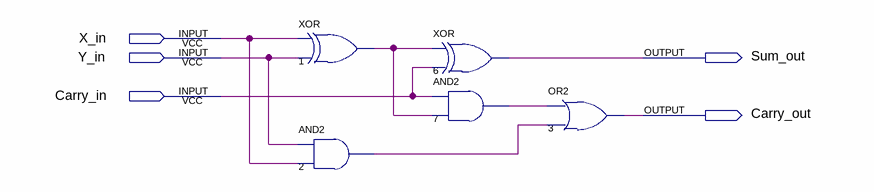
[diagram p0: schematic sheet]
// Quartus schematic fulladder1bit.bdf as structural Verilog: 5 symbols, 5 pins
module fulladder1bit (
  input  X_in,
  input  Y_in,
  input  Carry_in,
  output Sum_out,
  output Carry_out
);

  wire n1_out, n2_out, n7_out;

  xor u_1 (n1_out, X_in, Y_in);
  and u_2 (n2_out, Y_in, X_in);
  xor u_6 (Sum_out, n1_out, Carry_in);
  and u_7 (n7_out, Carry_in, n1_out);
  or u_3 (Carry_out, n7_out, n2_out);
endmodule
